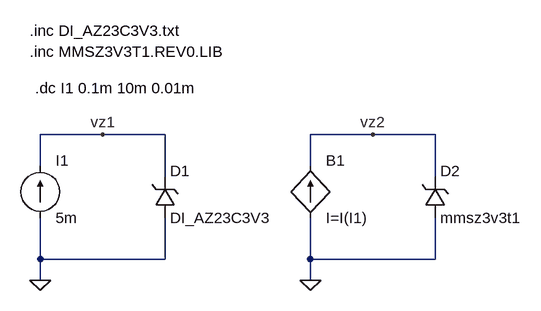
[diagram p0: schematic Z3V3_test.asc]
Z3V3_test.asc, the LTspice schematic file:
Version 4
SHEET 1 880 680
WIRE 64 64 -32 64
WIRE 160 64 64 64
WIRE 480 64 384 64
WIRE 576 64 480 64
WIRE -32 112 -32 64
WIRE 384 112 384 64
WIRE 160 128 160 64
WIRE 576 128 576 64
WIRE -32 256 -32 192
WIRE 160 256 160 192
WIRE 160 256 -32 256
WIRE 384 256 384 192
WIRE 576 256 576 192
WIRE 576 256 384 256
WIRE -32 288 -32 256
WIRE 384 288 384 256
FLAG -32 288 0
FLAG 64 64 vz1
FLAG 384 288 0
FLAG 480 64 vz2
SYMBOL zener 144 192 M180
WINDOW 0 24 72 Left 0
WINDOW 3 24 0 Left 0
SYMATTR InstName D1
SYMATTR Value DI_AZ23C3V3
SYMATTR Prefix X
SYMBOL current -32 192 M180
WINDOW 0 24 88 Left 0
WINDOW 3 24 0 Left 0
SYMATTR InstName I1
SYMATTR Value 5m
SYMBOL zener 560 192 M180
WINDOW 0 24 72 Left 0
WINDOW 3 24 0 Left 0
SYMATTR InstName D2
SYMATTR Value mmsz3v3t1
SYMATTR Prefix X
SYMBOL bi 384 192 M180
WINDOW 0 24 88 Left 0
WINDOW 3 24 0 Left 0
SYMATTR InstName B1
SYMATTR Value I=I(I1)
TEXT -40 -8 Left 0 !.dc I1 0.1m 10m 0.01m
TEXT -48 -96 Left 0 !.inc DI_AZ23C3V3.txt
TEXT -48 -64 Left 0 !.inc MMSZ3V3T1.REV0.LIB

The netlist it stands for:
* Z3V3_test.asc
XD1 0 vz1 DI_AZ23C3V3  ; pins + -
I1 0 vz1 5m
XD2 0 vz2 mmsz3v3t1  ; pins + -
B1 0 vz2 I=I(I1)
.dc I1 0.1m 10m 0.01m
.inc DI_AZ23C3V3.txt
.inc MMSZ3V3T1.REV0.LIB
.backanno
.end